# Altium schematic sheet SH3 - 5V POWER.SchDoc: Load Monitoring 1
size B; CheckedBy: Cindy Li; Engineer: Farris Matar; Organization: UW Robotics; Address1: 200 University Avenue; Address2: Waterloo; Address3: Ontario; Address4: Canada N2L 3G6; DocumentNumber: 5; Revision: 3; SheetNumber: 5; SheetTotal: 9
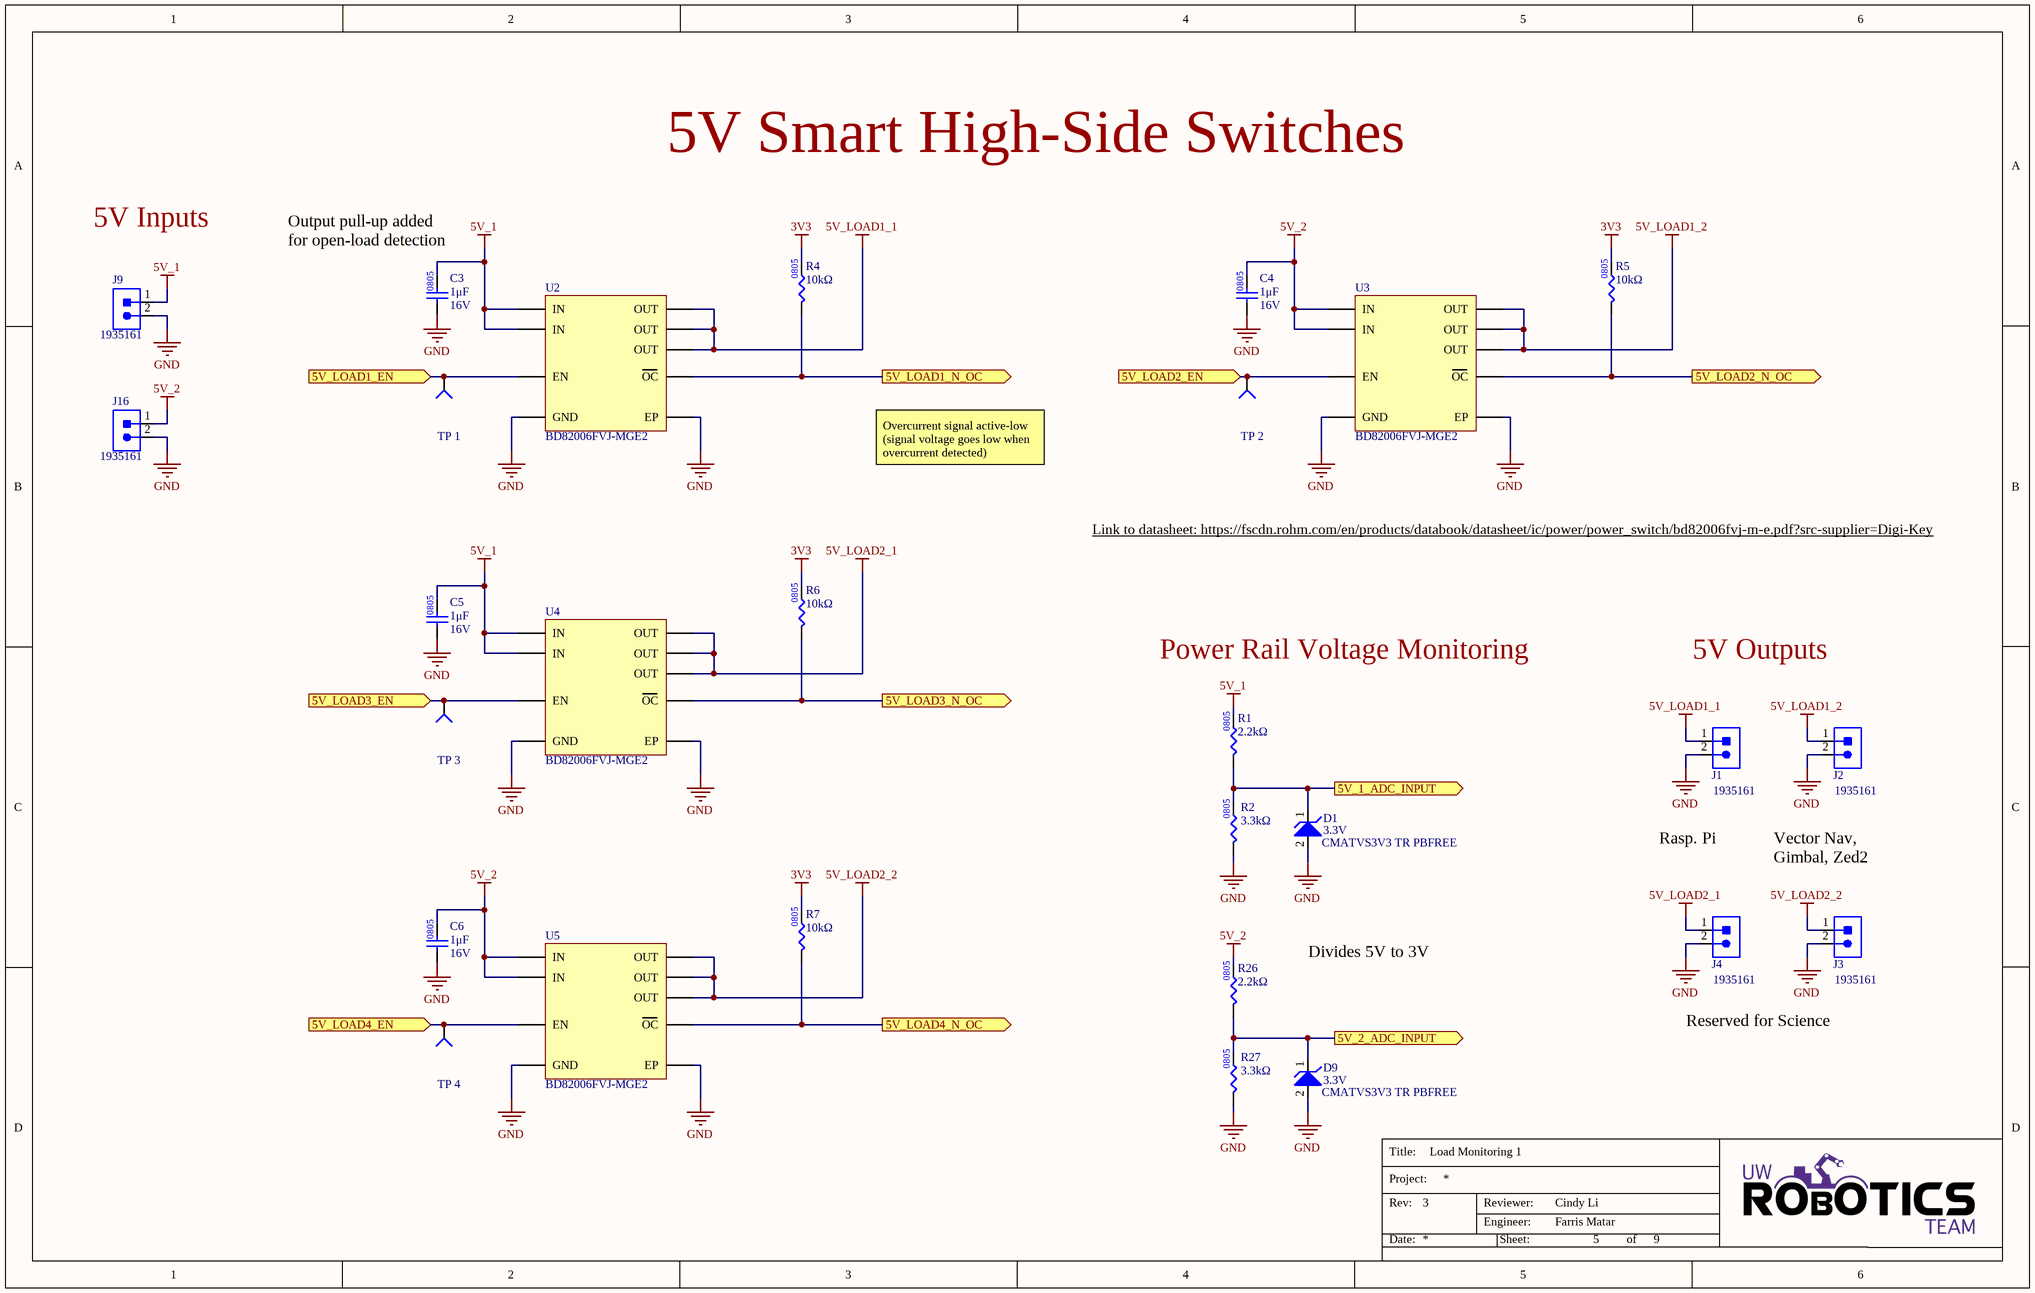
[diagram p0: SH3 - 5V POWER.SchDoc]

## Parts
C3  value 1μF  Voltage Rating: 16V  [CAP0805]  (hidden comment: CAP_1uF_16V_0805)
C4  value 1μF  Voltage Rating: 16V  [CAP0805]  (hidden comment: CAP_1uF_16V_0805)
C5  value 1μF  Voltage Rating: 16V  [CAP0805]  (hidden comment: CAP_1uF_16V_0805)
C6  value 1μF  Voltage Rating: 16V  [CAP0805]  (hidden comment: CAP_1uF_16V_0805)
D1  Manufacturer Part Number 1: CMATVS3V3 TR PBFREE  Voltage - Reverse Standoff (Typ): 3.3V  [SOD-923]  (hidden comment: TVS_DIODE_UNIDIR_3.3V_7A)
D9  Manufacturer Part Number 1: CMATVS3V3 TR PBFREE  Voltage - Reverse Standoff (Typ): 3.3V  [SOD-923]  (hidden comment: TVS_DIODE_UNIDIR_3.3V_7A)
J1  CON_2M_TERM  [1935161]  (value not drawn)
J2  CON_2M_TERM  [1935161]  (value not drawn)
J3  CON_2M_TERM  [1935161]  (value not drawn)
J4  CON_2M_TERM  [1935161]  (value not drawn)
J9  CON_2M_TERM  [1935161]  (value not drawn)
J16  CON_2M_TERM  [1935161]  (value not drawn)
R1  value 2.2kΩ  [RES0805]  (hidden comment: RES_2.2kΩ_0805)
R2  value 3.3kΩ  [RES0805]  (hidden comment: RES_3.3kΩ_0805_1%)
R4  value 10kΩ  [RES0805]  (hidden comment: RES_10kΩ_0805_5%)
R5  value 10kΩ  [RES0805]  (hidden comment: RES_10kΩ_0805_5%)
R6  value 10kΩ  [RES0805]  (hidden comment: RES_10kΩ_0805_5%)
R7  value 10kΩ  [RES0805]  (hidden comment: RES_10kΩ_0805_5%)
R26  value 2.2kΩ  [RES0805]  (hidden comment: RES_2.2kΩ_0805)
R27  value 3.3kΩ  [RES0805]  (hidden comment: RES_3.3kΩ_0805_1%)
TP_1  TESTPOINT_1MM_CIRCLE  [TESTPOINT_CIRCLE_1MM]  (value not drawn)  (no BOM)
TP_2  TESTPOINT_1MM_CIRCLE  [TESTPOINT_CIRCLE_1MM]  (value not drawn)  (no BOM)
TP_3  TESTPOINT_1MM_CIRCLE  [TESTPOINT_CIRCLE_1MM]  (value not drawn)  (no BOM)
TP_4  TESTPOINT_1MM_CIRCLE  [TESTPOINT_CIRCLE_1MM]  (value not drawn)  (no BOM)
U2  BD82006FVJ-MGE2  [8-TSSOP-BJ]
U3  BD82006FVJ-MGE2  [8-TSSOP-BJ]
U4  BD82006FVJ-MGE2  [8-TSSOP-BJ]
U5  BD82006FVJ-MGE2  [8-TSSOP-BJ]

## Ports
5V_1_ADC_INPUT (out), 5V_2_ADC_INPUT (out), 5V_LOAD1_EN (in), 5V_LOAD1_N_OC (out), 5V_LOAD2_EN (in), 5V_LOAD2_N_OC (out), 5V_LOAD3_EN (in), 5V_LOAD3_N_OC (out), 5V_LOAD4_EN (in), 5V_LOAD4_N_OC (out)

## Nets
3V3: R4.2 R5.2 R6.2 R7.2
5V_1: C3.2 C5.2 J9.1 R1.2 U2.2(IN) U2.3(IN) U4.2(IN) U4.3(IN)
5V_2: C4.2 C6.2 J16.1 R26.2 U3.2(IN) U3.3(IN) U5.2(IN) U5.3(IN)
5V_LOAD1_1: J1.1 U2.5(OUT) U2.6(OUT) U2.7(OUT)
5V_LOAD1_2: J2.1 U3.5(OUT) U3.6(OUT) U3.7(OUT)
5V_LOAD2_1: J4.1 U4.5(OUT) U4.6(OUT) U4.7(OUT)
5V_LOAD2_2: J3.1 U5.5(OUT) U5.6(OUT) U5.7(OUT)
GND: C3.1 C4.1 C5.1 C6.1 D1.2 D9.2 J1.2 J2.2 J3.2 J4.2 J9.2 J16.2 R2.1 R27.1 U2.1(GND) U2.9(EP) U3.1(GND) U3.9(EP) U4.1(GND) U4.9(EP) U5.1(GND) U5.9(EP)
5V_1_ADC_INPUT: D1.1 R1.1 R2.2 ; port 5V_1_ADC_INPUT
5V_2_ADC_INPUT: D9.1 R26.1 R27.2 ; port 5V_2_ADC_INPUT
5V_LOAD1_EN: TP_1.1(=value) U2.4(EN) ; port 5V_LOAD1_EN
5V_LOAD1_N_OC: R4.1 U2.8(OC) ; port 5V_LOAD1_N_OC
5V_LOAD2_EN: TP_2.1(=value) U3.4(EN) ; port 5V_LOAD2_EN
5V_LOAD2_N_OC: R5.1 U3.8(OC) ; port 5V_LOAD2_N_OC
5V_LOAD3_EN: TP_3.1(=value) U4.4(EN) ; port 5V_LOAD3_EN
5V_LOAD3_N_OC: R6.1 U4.8(OC) ; port 5V_LOAD3_N_OC
5V_LOAD4_EN: TP_4.1(=value) U5.4(EN) ; port 5V_LOAD4_EN
5V_LOAD4_N_OC: R7.1 U5.8(OC) ; port 5V_LOAD4_N_OC

## Notes on the sheet
- 5V Smart High-Side Switches
- 5V Inputs
- (near C3) Output pull-up added for open-load detection
- Overcurrent signal active-low (signal voltage goes low when overcurrent detected)
- Link to datasheet: https://fscdn.rohm.com/en/products/databook/datasheet/ic/power/power_switch/bd82006fvj-m-e.pdf?src-supplier=Digi-Key <https://fscdn.rohm.com/en/products/databook/datasheet/ic/power/power_switch/bd82006fvj-m-e.pdf?src-supplier=Digi-Key>
- Power Rail Voltage Monitoring
- 5V Outputs
- Rasp. Pi
- Vector Nav, Gimbal, Zed2
- Divides 5V to 3V
- Reserved for Science
- Title:
- Project:
- Date:
- Rev:
- Reviewer:
- Engineer:
- Sheet:
- of

## Library data of the parts
C3-C6 = CAP_1uF_16V_0805: CAP CER 1UF 16V X7R 0805; Manufacturer 1: Yageo; Manufacturer Part Number 1: CC0805KKX7R7BB105; Mounting Type: SMD; Supplier 1: Digi-Key; Supplier Part Number 1: 311-1365-1-ND; Package: 0805; Dielectric: X7R
D1 D9 = TVS_DIODE_UNIDIR_3.3V_7A: TVS DIODE 3.3VWM 11VC SOD923; Manufacturer 1: Central Semiconductor Corp; Voltage - Breakdown (Min): 5V; Voltage - Clamping (Max) @ Ipp: 11V; Mounting Type: SMD; Package/Footprint: SOD-923; Supplier 1: Digi-Key; Supplier Part Number 1: 1514-CMATVS3V3TRPBFREECT-ND; Supplier 2: Mouser; Supplier Part Number 2: 610-CMATVS3V3
J1-J4 J9 J16 = CON_2M_TERM: TERM BLK 2POS SIDE ENTRY 5MM; Manufacturer 1: Phoenix Contact; Max Current Rating: 16A; Current: 18A; Voltage: 300V; Package/Footprint: SMD; Supplier 1: Digi-Key; Supplier Part Number 1: 277-1667-ND; Manufacturer Part Number 1: 1935161; Mounting Type: TH
R1 R26 = RES_2.2kΩ_0805_5%: RES 2.2K OHM 5% 1/8W 0805; Manufacturer 1: Vishay Dale; Manufacturer Part Number 1: CRCW08052K20JNEAC; Supplier Part Number 1: 541-4169-1-ND; Supplier 1: Digi-Key; Tolerance: 5%; Package: 0805
R2 R27 = RES_3.3kΩ_0805_1%: RES 3.3K OHM 1% 1/8W 0805; Manufacturer 1: Vishay Dale; Manufacturer Part Number 1: CRCW06033K30FKEA; Supplier 1: Digi-Key; Supplier Part Number 1: 541-3.30KHCT-ND; LCSC Part #: C26010; Mounting Type: SMD; Package: 0805
R4-R7 = RES_10kΩ_0805_5%: RES 10K OHM 5% 1/8W 0805; Manufacturer 1: Panasonic Electronic Components; Manufacturer Part Number 1: ERJ-6GEYJ103V; Package/Footprint: 0805; Supplier 1: Digi-Key; Supplier Part Number 1: P10KACT-ND; LCSC Part #: C17414; Mounting Type: SMD
TP_1-TP_4 = TESTPOINT_1MM_CIRCLE: TESTPOINT 1MM CIRCLE
U2-U5 = BD82006FVJ-MGE2: IC PWR SWITCH N-CHAN 1:1 8TSSOP; Manufacturer 1: Rohm Semiconductor; Package/Footprint: 8-TSSOP; Rds On (Typ): 70mOhm; Mounting Type: SMD; Supplier 1: Digi-Key; Supplier Part Number 1: BD82006FVJ-MGE2CT-ND; Manufacturer Part Number 1: BD82006FVJ-MGE2